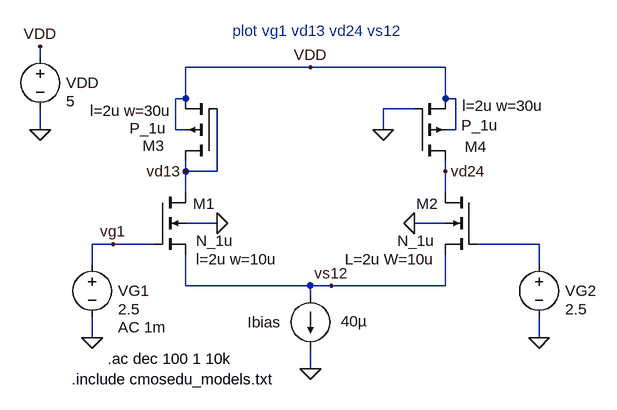
[diagram p0: schematic Fig9_19.asc]
Fig9_19.asc, the LTspice schematic file:
Version 4
SHEET 1 1328 680
WIRE 288 -272 288 -288
WIRE 704 -256 512 -256
WIRE 912 -256 704 -256
WIRE 512 -208 512 -256
WIRE 512 -208 496 -208
WIRE 912 -208 912 -256
WIRE 928 -208 912 -208
WIRE 864 -192 816 -192
WIRE 288 -160 288 -192
WIRE 496 -160 496 -208
WIRE 512 -160 496 -160
WIRE 816 -160 816 -192
WIRE 928 -160 928 -208
WIRE 928 -160 912 -160
WIRE 560 -96 560 -192
WIRE 512 -96 512 -112
WIRE 560 -96 512 -96
WIRE 912 -96 912 -112
WIRE 512 -64 512 -96
WIRE 912 -64 912 -96
WIRE 560 -16 512 -16
WIRE 912 -16 864 -16
WIRE 400 16 368 16
WIRE 464 16 400 16
WIRE 1056 16 960 16
WIRE 368 48 368 16
WIRE 1056 48 1056 16
WIRE 512 80 512 32
WIRE 704 80 512 80
WIRE 736 80 704 80
WIRE 912 80 912 32
WIRE 912 80 736 80
WIRE 704 96 704 80
WIRE 368 160 368 128
WIRE 1056 160 1056 128
WIRE 704 208 704 176
FLAG 288 -160 0
FLAG 864 -16 0
FLAG 560 -16 0
FLAG 704 208 0
FLAG 288 -288 VDD
FLAG 704 -256 VDD
FLAG 816 -160 0
FLAG 368 160 0
FLAG 1056 160 0
FLAG 512 -96 vd13
FLAG 912 -96 vd24
FLAG 736 80 vs12
FLAG 400 16 vg1
SYMBOL nmos4 960 -64 M0
WINDOW 0 59 18 Left 2
WINDOW 3 64 75 Left 2
WINDOW 123 64 103 Left 2
SYMATTR InstName M2
SYMATTR Value N_1u
SYMATTR Value2 L=2u W=10u
SYMBOL voltage 288 -288 R0
WINDOW 0 40 56 Left 2
WINDOW 3 40 84 Left 2
WINDOW 123 0 0 Left 2
WINDOW 39 0 0 Left 2
SYMATTR InstName VDD
SYMATTR Value 5
SYMBOL current 704 96 R0
WINDOW 0 -97 40 Left 2
WINDOW 3 47 39 Left 2
WINDOW 123 0 0 Left 2
WINDOW 39 0 0 Left 2
SYMATTR InstName Ibias
SYMATTR Value 40µ
SYMBOL nmos4 464 -64 R0
WINDOW 0 59 18 Left 2
WINDOW 3 64 75 Left 2
WINDOW 123 64 103 Left 2
SYMATTR InstName M1
SYMATTR Value N_1u
SYMATTR Value2 l=2u w=10u
SYMBOL pmos4 864 -112 M180
WINDOW 0 78 22 Left 2
WINDOW 3 72 55 Left 2
WINDOW 123 74 85 Left 2
SYMATTR InstName M4
SYMATTR Value P_1u
SYMATTR Value2 l=2u w=30u
SYMBOL pmos4 560 -112 R180
WINDOW 0 81 23 Left 2
WINDOW 3 78 50 Left 2
WINDOW 123 70 77 Left 2
SYMATTR InstName M3
SYMATTR Value P_1u
SYMATTR Value2 l=2u w=30u
SYMBOL voltage 368 32 R0
WINDOW 0 40 56 Left 2
WINDOW 3 40 84 Left 2
WINDOW 123 40 112 Left 2
WINDOW 39 0 0 Left 2
SYMATTR InstName VG1
SYMATTR Value 2.5
SYMATTR Value2 AC 1m
SYMBOL voltage 1056 32 R0
WINDOW 0 40 56 Left 2
WINDOW 3 40 84 Left 2
WINDOW 123 0 0 Left 2
WINDOW 39 0 0 Left 2
SYMATTR InstName VG2
SYMATTR Value 2.5
TEXT 336 224 Left 2 !.include cmosedu_models.txt
TEXT 392 192 Left 2 !.ac dec 100 1 10k
TEXT 584 -312 Left 2 ;plot vg1 vd13 vd24 vs12

The netlist it stands for:
* Fig9_19.asc
M2 vd24 N001 vs12 0 N_1u L=2u W=10u
VDD VDD 0 5
Ibias vs12 0 40µ
M1 vd13 vg1 vs12 0 N_1u l=2u w=10u
M4 vd24 0 VDD VDD P_1u l=2u w=30u
M3 vd13 vd13 VDD VDD P_1u l=2u w=30u
VG1 vg1 0 2.5 AC 1m
VG2 N001 0 2.5
.model NMOS NMOS
.model PMOS PMOS
.lib standard.mos
.include cmosedu_models.txt
.ac dec 100 1 10k
* plot vg1 vd13 vd24 vs12
.backanno
.end